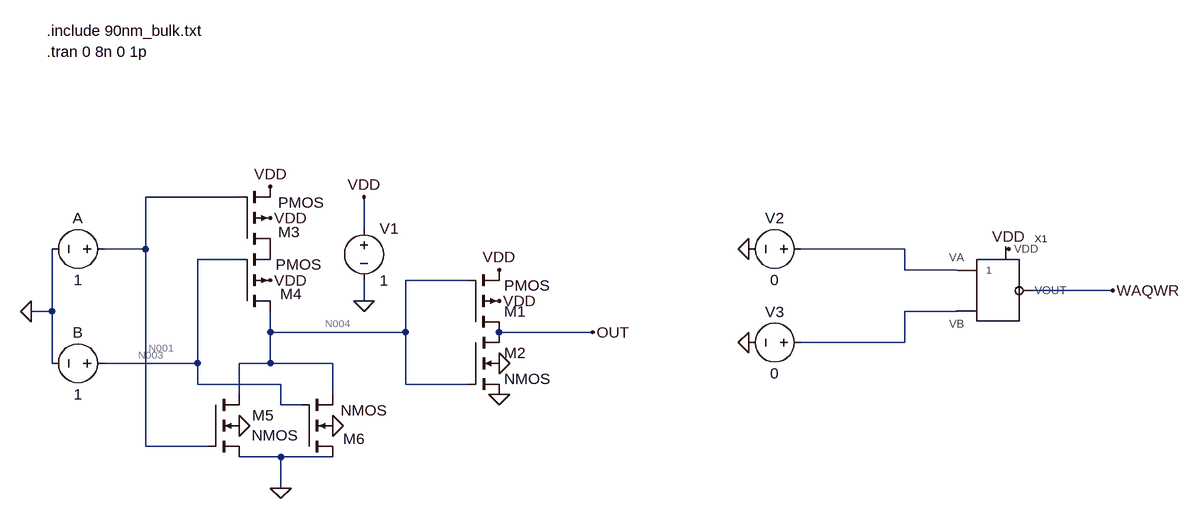
[diagram p0: schematic Draft5.asc]
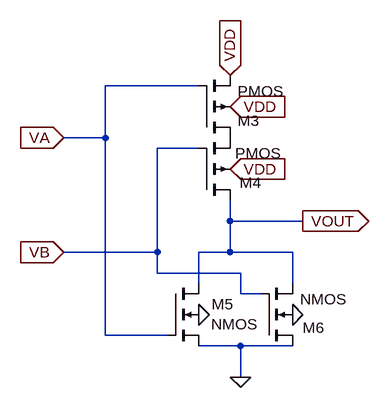
[diagram p1: sub-circuit nor.asc]
Draft5.asc, the LTspice schematic file:
Version 4
SHEET 1 880 680
WIRE -656 -16 -800 -16
WIRE -464 32 -464 -16
WIRE -800 64 -800 -16
WIRE -800 64 -864 64
WIRE 368 64 208 64
WIRE -656 80 -720 80
WIRE 368 96 368 64
WIRE 448 96 368 96
WIRE -304 112 -400 112
WIRE 688 128 560 128
WIRE -464 144 -464 112
WIRE -944 160 -944 64
WIRE -944 160 -976 160
WIRE 448 160 368 160
WIRE -608 192 -608 160
WIRE -400 192 -400 112
WIRE -400 192 -608 192
WIRE -112 192 -256 192
WIRE 368 208 368 160
WIRE 368 208 208 208
WIRE -944 240 -944 160
WIRE -720 240 -720 80
WIRE -720 240 -864 240
WIRE -608 240 -608 192
WIRE -608 240 -656 240
WIRE -512 240 -608 240
WIRE -720 272 -720 240
WIRE -592 272 -720 272
WIRE -400 272 -400 192
WIRE -304 272 -400 272
WIRE -656 288 -656 240
WIRE -512 288 -512 240
WIRE -592 304 -592 272
WIRE -560 304 -592 304
WIRE -800 368 -800 64
WIRE -704 368 -800 368
WIRE -592 384 -656 384
WIRE -512 384 -592 384
WIRE -592 432 -592 384
FLAG -256 288 0
FLAG -976 160 0
FLAG -592 432 0
FLAG -464 144 0
FLAG -464 -16 VDD
FLAG -608 -32 VDD
FLAG -608 16 VDD
FLAG -608 112 VDD
FLAG -656 336 0
FLAG -512 336 0
FLAG -256 144 VDD
FLAG -256 240 0
FLAG -112 192 OUT
FLAG -256 96 VDD
FLAG 128 64 0
FLAG 128 208 0
FLAG 688 128 WAQWR
FLAG 528 64 VDD
SYMBOL pmos4 -304 192 M180
SYMATTR InstName M1
SYMBOL nmos4 -304 192 R0
SYMATTR InstName M2
SYMBOL voltage -848 64 R90
WINDOW 0 -32 56 VBottom 2
WINDOW 3 32 56 VTop 2
WINDOW 123 0 0 Left 0
WINDOW 39 0 0 Left 0
SYMATTR InstName A
SYMATTR Value 1
SYMBOL voltage -848 240 R90
WINDOW 0 -32 56 VBottom 2
WINDOW 3 32 56 VTop 2
WINDOW 123 0 0 Left 0
WINDOW 39 0 0 Left 0
SYMATTR InstName B
SYMATTR Value 1
SYMBOL pmos4 -656 64 M180
WINDOW 0 60 26 Left 2
WINDOW 3 60 72 Left 2
SYMATTR InstName M3
SYMBOL pmos4 -656 160 M180
WINDOW 0 63 27 Left 2
SYMATTR InstName M4
SYMBOL nmos4 -704 288 R0
WINDOW 0 68 32 Left 2
WINDOW 3 67 63 Left 2
SYMATTR InstName M5
SYMBOL nmos4 -560 384 M180
WINDOW 0 64 28 Left 2
WINDOW 3 60 72 Left 2
SYMATTR InstName M6
SYMBOL voltage -464 16 R0
WINDOW 123 0 0 Left 0
WINDOW 39 0 0 Left 0
SYMATTR InstName V1
SYMATTR Value 1
SYMBOL voltage 224 64 R90
WINDOW 0 -32 56 VBottom 2
WINDOW 3 32 56 VTop 2
WINDOW 123 0 0 Left 0
WINDOW 39 0 0 Left 0
SYMATTR InstName V2
SYMATTR Value 0
SYMBOL nor 512 128 R0
SYMATTR InstName X1
SYMBOL voltage 224 208 R90
WINDOW 0 -32 56 VBottom 2
WINDOW 3 32 56 VTop 2
WINDOW 123 0 0 Left 0
WINDOW 39 0 0 Left 0
SYMATTR InstName V3
SYMATTR Value 0
TEXT -952 -240 Left 2 !.tran 0 8n 0 1p
TEXT -952 -272 Left 2 !.include 90nm_bulk.txt

nor.asc, the sub-circuit schematic file:
Version 4
SHEET 1 880 680
WIRE -656 -16 -800 -16
WIRE -800 64 -800 -16
WIRE -800 64 -864 64
WIRE -656 80 -720 80
WIRE -608 192 -608 160
WIRE -496 192 -608 192
WIRE -720 240 -720 80
WIRE -720 240 -864 240
WIRE -608 240 -608 192
WIRE -608 240 -656 240
WIRE -512 240 -608 240
WIRE -720 272 -720 240
WIRE -592 272 -720 272
WIRE -656 288 -656 240
WIRE -512 288 -512 240
WIRE -592 304 -592 272
WIRE -560 304 -592 304
WIRE -800 368 -800 64
WIRE -704 368 -800 368
WIRE -592 384 -656 384
WIRE -512 384 -592 384
WIRE -592 432 -592 384
FLAG -592 432 0
FLAG -608 -32 VDD
IOPIN -608 -32 In
FLAG -656 336 0
FLAG -512 336 0
FLAG -864 64 VA
IOPIN -864 64 In
FLAG -864 240 VB
IOPIN -864 240 In
FLAG -496 192 VOUT
IOPIN -496 192 Out
FLAG -608 16 VDD
IOPIN -608 16 In
FLAG -608 112 VDD
IOPIN -608 112 In
SYMBOL pmos4 -656 64 M180
WINDOW 0 60 26 Left 2
WINDOW 3 60 72 Left 2
SYMATTR InstName M3
SYMBOL pmos4 -656 160 M180
WINDOW 0 63 27 Left 2
SYMATTR InstName M4
SYMBOL nmos4 -704 288 R0
WINDOW 0 68 32 Left 2
WINDOW 3 67 63 Left 2
SYMATTR InstName M5
SYMBOL nmos4 -560 384 M180
WINDOW 0 64 28 Left 2
WINDOW 3 60 72 Left 2
SYMATTR InstName M6

The netlist it stands for:
* Draft5.asc
M1 OUT N004 VDD VDD PMOS
M2 OUT N004 0 0 NMOS
V§A N001 0 1
V§B N003 0 1
M3 P001 N001 VDD VDD PMOS
M4 N004 N003 P001 VDD PMOS
M5 N004 N001 0 0 NMOS
M6 0 N003 N004 0 NMOS
V1 VDD 0 1
V2 N002 0 0
XX1 N002 N005 VDD WAQWR nor
V3 N005 0 0

* block symbol definitions
.subckt nor VA VB VDD VOUT
M3 P001 VA VDD VDD PMOS
M4 VOUT VB P001 VDD PMOS
M5 VOUT VA 0 0 NMOS
M6 0 VB VOUT 0 NMOS
.ends nor

.model NMOS NMOS
.model PMOS PMOS
.lib standard.mos
.tran 0 8n 0 1p
.include 90nm_bulk.txt
.backanno
.end

* Results of the author's LTspice run, read from the files saved beside the schematic
* Operating Point, zero values left out:
*   V(out) = 999.9 mV
*   V(n004) = 1.591 mV
*   V(vdd) = 1 V
*   V(n001) = 1 V
*   V(n003) = 1 V
*   V(p001) = 981.2 mV
*   V(waqwr) = 999.7 mV
*   Id(M6) = -1.1 µA
*   Ig(M6) = 1.098 µA
*   Ib(M6) = -33.12 pA
*   Is(M6) = 1.718 nA
*   Id(M5) = 1.721 nA
*   Ig(M5) = 1.098 µA
*   Ib(M5) = -33.12 pA
*   Is(M5) = -1.1 µA
*   Id(M2) = 3.412 nA
*   Ig(M2) = -3.326 nA
*   Ib(M2) = -1.01 pA
*   Is(M2) = -84.96 pA
*   Id(M4) = -32.47 pA
*   Ig(M4) = 18.38 pA
*   Ib(M4) = 1.028 pA
*   Is(M4) = 13.06 pA
*   Id(M3) = -13.04 pA
*   Is(M3) = 13.02 pA
*   Id(M1) = -3.412 nA
*   Ig(M1) = -83.6 pA
*   Ib(M1) = 46.83 pA
*   Is(M1) = 3.449 nA
*   I(V3) = 3.439 nA
*   I(V2) = 3.439 nA
*   I(V1) = -10.55 nA
*   I(B) = -1.098 µA
*   I(A) = -1.098 µA
*   Ix(x1:VA) = -3.439 nA
*   Ix(x1:VB) = -3.439 nA
*   Ix(x1:VDD) = 7.044 nA